# EAGLE design MOL-v1 (EAGLE 8.2.2)
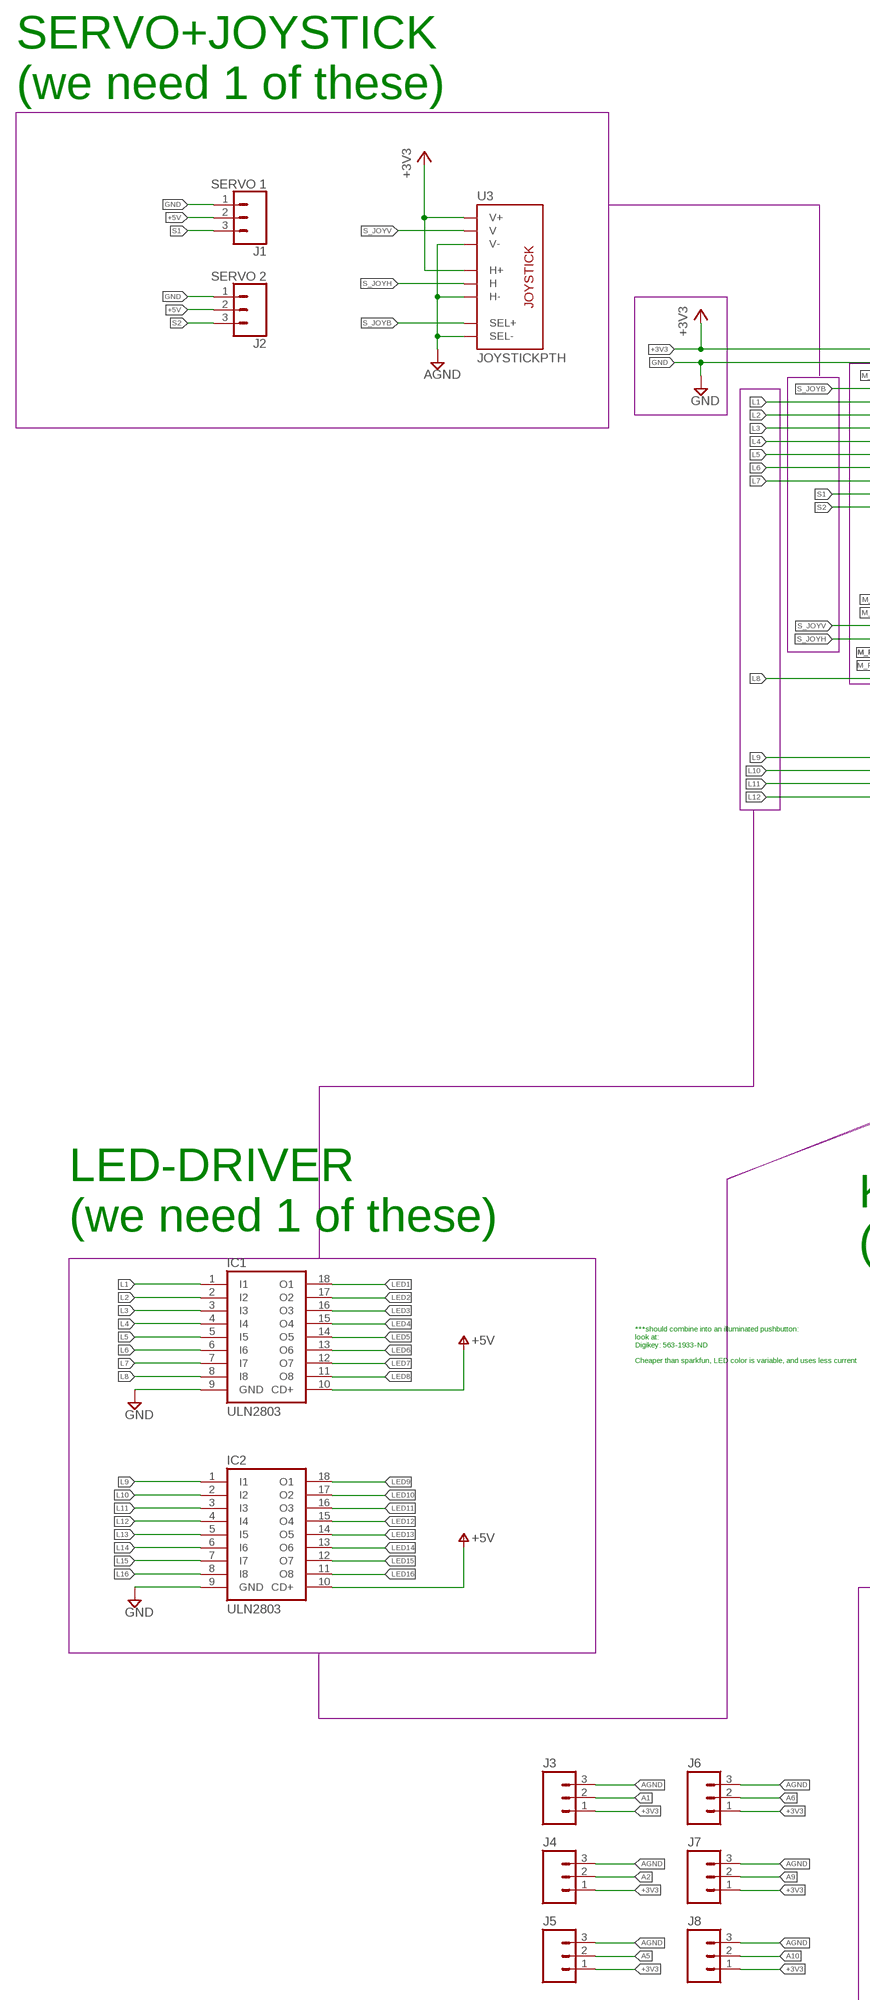
[diagram p0: schematic, sheet 1, part 1 of 2]
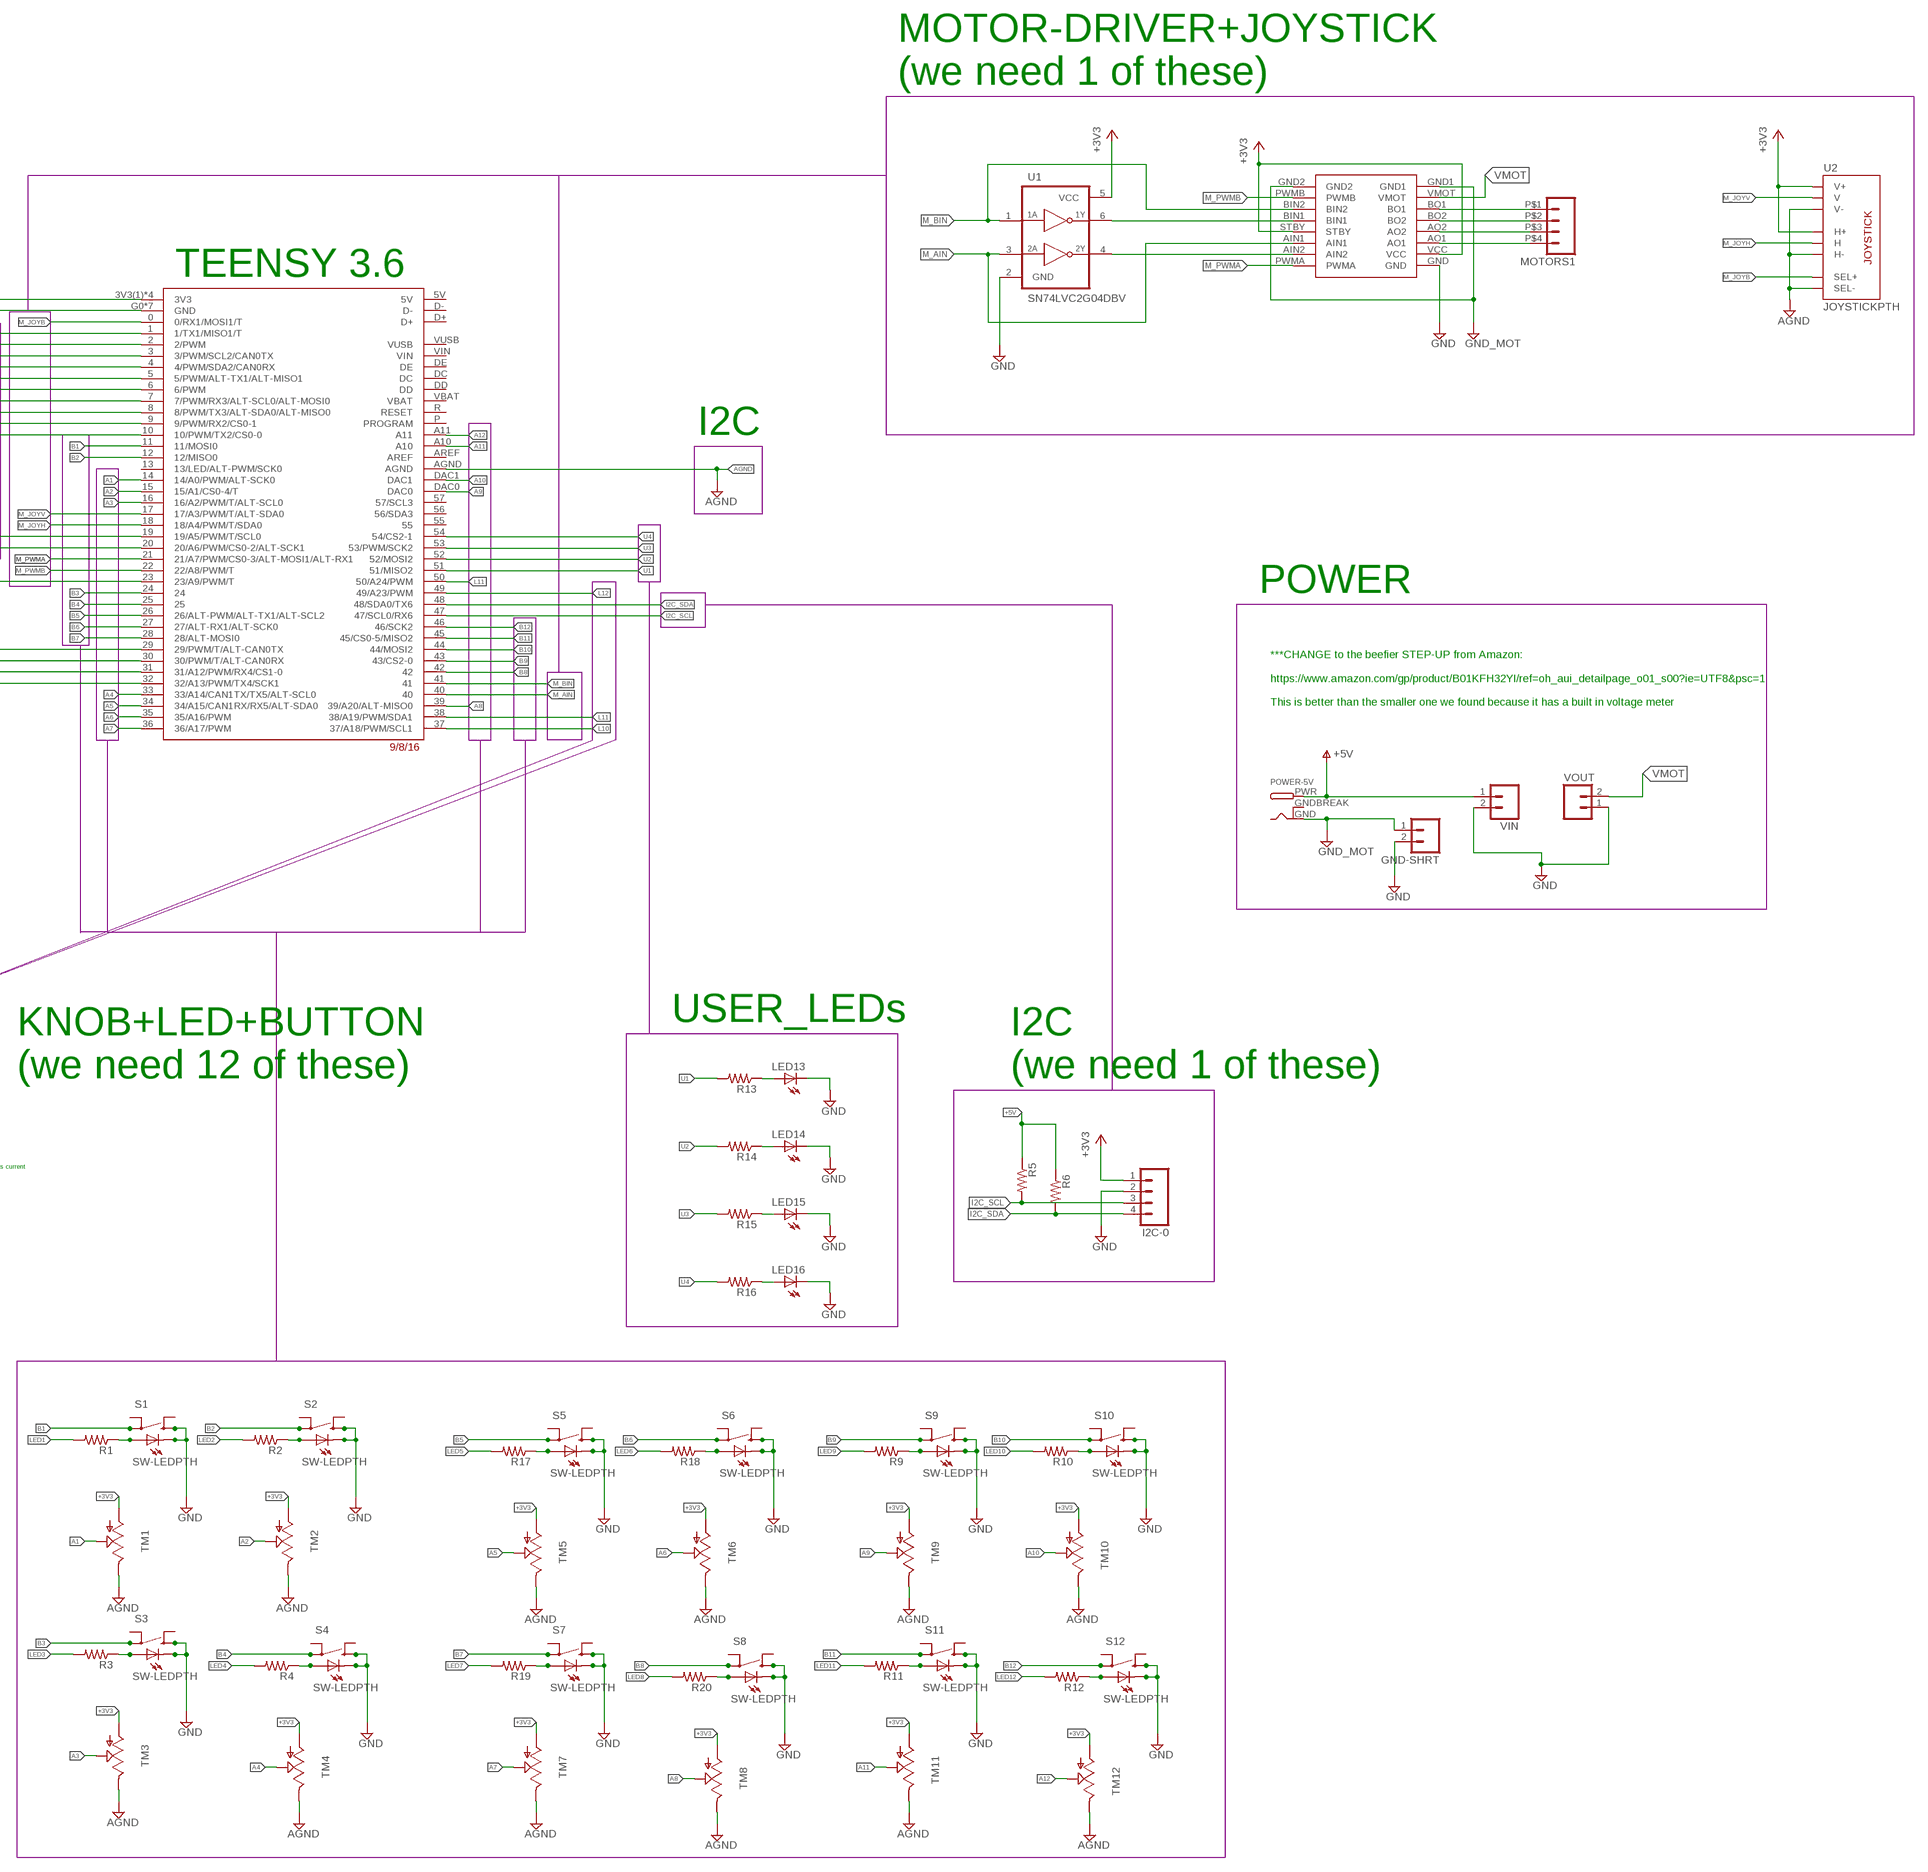
[diagram p1: schematic, sheet 1, part 2 of 2]

## Parts
GND-SHRT  M02LOCK  [1X02_LOCK]
I2C-0  M04LOCK  [1X04_LOCK]
IC1  ULN2803  ULN2803A  [DIL18]
IC2  ULN2803  ULN2803A  [DIL18]
J1  SERVO 1  CONN_03LOCK  [1X03_LOCK@1]
J2  SERVO 2  CONN_03LOCK  [1X03_LOCK@1]
J3  M031X03_NO_SILK  [1X03_NO_SILK]
J4  M031X03_NO_SILK  [1X03_NO_SILK]
J5  M031X03_NO_SILK  [1X03_NO_SILK]
J6  M031X03_NO_SILK  [1X03_NO_SILK]
J7  M031X03_NO_SILK  [1X03_NO_SILK]
J8  M031X03_NO_SILK  [1X03_NO_SILK]
LED13  LED3MM  [LED3MM]
LED14  LED3MM  [LED3MM]
LED15  LED3MM  [LED3MM]
LED16  LED3MM  [LED3MM]
MOTORS1  M04  [SPRINGTERMINAL-2.54MM-4]
POWER-5V  DCBARRELPTH  [DCJACK_2MM_PTH]
R1  RESISTOREZ  [AXIAL-0.3EZ]
R2  RESISTOREZ  [AXIAL-0.3EZ]
R3  RESISTOREZ  [AXIAL-0.3EZ]
R4  RESISTOREZ  [AXIAL-0.3EZ]
R5  RESISTOREZ  [AXIAL-0.3EZ]
R6  RESISTOREZ  [AXIAL-0.3EZ]
R9  RESISTOREZ  [AXIAL-0.3EZ]
R10  RESISTOREZ  [AXIAL-0.3EZ]
R11  RESISTOREZ  [AXIAL-0.3EZ]
R12  RESISTOREZ  [AXIAL-0.3EZ]
R13  RESISTOREZ  [AXIAL-0.3EZ]
R14  RESISTOREZ  [AXIAL-0.3EZ]
R15  RESISTOREZ  [AXIAL-0.3EZ]
R16  RESISTOREZ  [AXIAL-0.3EZ]
R17  RESISTOREZ  [AXIAL-0.3EZ]
R18  RESISTOREZ  [AXIAL-0.3EZ]
R19  RESISTOREZ  [AXIAL-0.3EZ]
R20  RESISTOREZ  [AXIAL-0.3EZ]
S1  SW-LEDPTH  [TR2-SWITCH-MOMENTARY-LED]
S2  SW-LEDPTH  [TR2-SWITCH-MOMENTARY-LED]
S3  SW-LEDPTH  [TR2-SWITCH-MOMENTARY-LED]
S4  SW-LEDPTH  [TR2-SWITCH-MOMENTARY-LED]
S5  SW-LEDPTH  [TR2-SWITCH-MOMENTARY-LED]
S6  SW-LEDPTH  [TR2-SWITCH-MOMENTARY-LED]
S7  SW-LEDPTH  [TR2-SWITCH-MOMENTARY-LED]
S8  SW-LEDPTH  [TR2-SWITCH-MOMENTARY-LED]
S9  SW-LEDPTH  [TR2-SWITCH-MOMENTARY-LED]
S10  SW-LEDPTH  [TR2-SWITCH-MOMENTARY-LED]
S11  SW-LEDPTH  [TR2-SWITCH-MOMENTARY-LED]
S12  SW-LEDPTH  [TR2-SWITCH-MOMENTARY-LED]
TM1  TRIM  [TRIM-PCB-9MM]
TM2  TRIM  [TRIM-PCB-9MM]
TM3  TRIM  [TRIM-PCB-9MM]
TM4  TRIM  [TRIM-PCB-9MM]
TM5  TRIM  [TRIM-PCB-9MM]
TM6  TRIM  [TRIM-PCB-9MM]
TM7  TRIM  [TRIM-PCB-9MM]
TM8  TRIM  [TRIM-PCB-9MM]
TM9  TRIM  [TRIM-PCB-9MM]
TM10  TRIM  [TRIM-PCB-9MM]
TM11  TRIM  [TRIM-PCB-9MM]
TM12  TRIM  [TRIM-PCB-9MM]
U1  SN74LVC2G04DBV  [SOT23-6]
U2  JOYSTICKPTH  [JOYSTICK]
U3  JOYSTICKPTH  [JOYSTICK]
U$1  TEENSY3_6--ALLPINS  [T36]
U$7  POLOLU_TB6612FNG  [POLOLU_TB6612FNG]
VIN  M02LOCK  [1X02_LOCK]
VOUT  M02LOCK  [1X02_LOCK]

## Nets
+3V3: I2C-0.1 J3.1 J4.1 J5.1 J6.1 J7.1 J8.1 TM1.1(A) TM2.1(A) TM3.1(A) TM4.1(A) TM5.1(A) TM6.1(A) TM7.1(A) TM8.1(A) TM9.1(A) TM10.1(A) TM11.1(A) TM12.1(A) U1.5(VCC) U2.H1(H+) U2.V1(V+) U3.H1(H+) U3.V1(V+) U$1.3V3(1)(3V3) U$1.3V3(2)(3V3) U$1.3V3(3)(3V3) U$1.3V3(4)(3V3) U$7.STBY U$7.VCC
+5V [Power]: IC1.10(CD+) IC2.10(CD+) J1.2 J2.2 POWER-5V.PWR R5.P$1 R6.P$1 VIN.1 ; supply symbol labelled V+
A1 [Analog Sig]: J3.2 TM1.2(S) U$1.14(14/A0/PWM/ALT-SCK0)
A2 [Analog Sig]: J4.2 TM2.2(S) U$1.15(15/A1/CS0-4/T)
A3 [Analog Sig]: TM3.2(S) U$1.16(16/A2/PWM/T/ALT-SCL0)
A4 [Analog Sig]: TM4.2(S) U$1.33(33/A14/CAN1TX/TX5/ALT-SCL0)
A5 [Analog Sig]: J5.2 TM5.2(S) U$1.34(34/A15/CAN1RX/RX5/ALT-SDA0)
A6 [Analog Sig]: J6.2 TM6.2(S) U$1.35(35/A16/PWM)
A7 [Analog Sig]: TM7.2(S) U$1.36(36/A17/PWM)
A8 [Analog Sig]: TM8.2(S) U$1.39(39/A20/ALT-MISO0)
A9 [Analog Sig]: J7.2 TM9.2(S) U$1.DAC0
A10 [Analog Sig]: J8.2 TM10.2(S) U$1.DAC1
A11 [Analog Sig]: TM11.2(S) U$1.A10
A12 [Analog Sig]: TM12.2(S) U$1.A11
AGND [Analog Sig]: J3.3 J4.3 J5.3 J6.3 J7.3 J8.3 TM1.3(E) TM2.3(E) TM3.3(E) TM4.3(E) TM5.3(E) TM6.3(E) TM7.3(E) TM8.3(E) TM9.3(E) TM10.3(E) TM11.3(E) TM12.3(E) U2.B2A(SEL-) U2.H3(H-) U2.V3(V-) U3.B2A(SEL-) U3.H3(H-) U3.V3(V-) U$1.AGND
B1: S1.3 U$1.11(11/MOSI0)
B2: S2.3 U$1.12(12/MISO0)
B3: S3.3 U$1.24
B4: S4.3 U$1.25
B5: S5.3 U$1.26(26/ALT-PWM/ALT-TX1/ALT-SCL2)
B6: S6.3 U$1.27(27/ALT-RX1/ALT-SCK0)
B7: S7.3 U$1.28(28/ALT-MOSI0)
B8: S8.3 U$1.42
B9: S9.3 U$1.43(43/CS2-0)
B10: S10.3 U$1.44(44/MOSI2)
B11: S11.3 U$1.45(45/CS0-5/MISO2)
B12: S12.3 U$1.46(46/SCK2)
GND: GND-SHRT.2 I2C-0.2 IC1.9(GND) IC2.9(GND) J1.1 J2.1 LED13.K(C) LED14.K(C) LED15.K(C) LED16.K(C) S1.1 S1.C S2.1 S2.C S3.1 S3.C S4.1 S4.C S5.1 S5.C S6.1 S6.C S7.1 S7.C S8.1 S8.C S9.1 S9.C S10.1 S10.C S11.1 S11.C S12.1 S12.C U1.2(GND) U$1.G0(GND) U$1.G1(GND) U$1.G2(GND) U$1.G3(GND) U$1.G4(GND) U$1.G5(GND) U$1.G6(GND) U$7.GND VIN.2 VOUT.1
GND_MOT [Power]: GND-SHRT.1 POWER-5V.GND U$7.GND1 U$7.GND2
I2C_SCL: I2C-0.3 R5.P$2 U$1.47(47/SCL0/RX6)
I2C_SDA: I2C-0.4 R6.P$2 U$1.48(48/SDA0/TX6)
L1: IC1.1(I1) U$1.2(2/PWM)
L2: IC1.2(I2) U$1.3(3/PWM/SCL2/CAN0TX)
L3: IC1.3(I3) U$1.4(4/PWM/SDA2/CAN0RX)
L4: IC1.4(I4) U$1.5(5/PWM/ALT-TX1/ALT-MISO1)
L5: IC1.5(I5) U$1.6(6/PWM)
L6: IC1.6(I6) U$1.7(7/PWM/RX3/ALT-SCL0/ALT-MOSI0)
L7: IC1.7(I7) U$1.8(8/PWM/TX3/ALT-SDA0/ALT-MISO0)
L8: IC1.8(I8) U$1.23(23/A9/PWM/T)
L9: IC2.1(I1) U$1.29(29/PWM/T/ALT-CAN0TX)
L10: IC2.2(I2) U$1.30(30/PWM/T/ALT-CAN0RX) U$1.37(37/A18/PWM/SCL1)
L11: IC2.3(I3) U$1.31(31/A12/PWM/RX4/CS1-0) U$1.38(38/A19/PWM/SDA1) U$1.50(50/A24/PWM)
L12: IC2.4(I4) U$1.32(32/A13/PWM/TX4/SCK1) U$1.49(49/A23/PWM)
L13: IC2.5(I5)
L14: IC2.6(I6)
L15: IC2.7(I7)
L16: IC2.8(I8)
LED1: IC1.18(O1) R1.P$2
LED2: IC1.17(O2) R2.P$2
LED3: IC1.16(O3) R3.P$2
LED4: IC1.15(O4) R4.P$2
LED5: IC1.14(O5) R17.P$2
LED6: IC1.13(O6) R18.P$2
LED7: IC1.12(O7) R19.P$2
LED8: IC1.11(O8) R20.P$2
LED9: IC2.18(O1) R9.P$2
LED10: IC2.17(O2) R10.P$2
LED11: IC2.16(O3) R11.P$2
LED12: IC2.15(O4) R12.P$2
LED13: IC2.14(O5)
LED14: IC2.13(O6)
LED15: IC2.12(O7)
LED16: IC2.11(O8)
M_AIN: U1.3(2A) U$1.40 U$7.AIN1
M_BIN: U1.1(1A) U$1.41 U$7.BIN2
M_JOYB: U2.B1A(SEL+) U$1.0(0/RX1/MOSI1/T)
M_JOYH [Analog Sig]: U2.H2(H) U$1.18(18/A4/PWM/T/SDA0)
M_JOYV [Analog Sig]: U2.V2(V) U$1.17(17/A3/PWM/T/ALT-SDA0)
M_PWMA: U$1.21(21/A7/PWM/CS0-3/ALT-MOSI1/ALT-RX1) U$7.PWMA
M_PWMB: U$1.22(22/A8/PWM/T) U$7.PWMB
N$1: R1.P$1 S1.A
N$2: LED13.A R13.P$1
N$3: LED14.A R14.P$1
N$4: LED15.A R15.P$1
N$5: U1.6(1Y) U$7.BIN1
N$6: U1.4(2Y) U$7.AIN2
N$7: LED16.A R16.P$1
N$8: R2.P$1 S2.A
N$9: R3.P$1 S3.A
N$10: R4.P$1 S4.A
N$15: R9.P$1 S9.A
N$16: R10.P$1 S10.A
N$17: R11.P$1 S11.A
N$18: R12.P$1 S12.A
N$19: R17.P$1 S5.A
N$20: R18.P$1 S6.A
N$21: R19.P$1 S7.A
N$22: R20.P$1 S8.A
N$45 [Power]: MOTORS1.P$1 U$7.BO1
N$46 [Power]: MOTORS1.P$2 U$7.BO2
N$52 [Power]: MOTORS1.P$3 U$7.AO2
N$54 [Power]: MOTORS1.P$4 U$7.AO1
S1: J1.3 U$1.9(9/PWM/RX2/CS0-1)
S2: J2.3 U$1.10(10/PWM/TX2/CS0-0)
S_JOYB: U3.B1A(SEL+) U$1.1(1/TX1/MISO1/T)
S_JOYH [Analog Sig]: U3.H2(H) U$1.20(20/A6/PWM/CS0-2/ALT-SCK1)
S_JOYV [Analog Sig]: U3.V2(V) U$1.19(19/A5/PWM/T/SCL0)
U1: R13.P$2 U$1.51(51/MISO2)
U2: R14.P$2 U$1.52(52/MOSI2)
U3: R15.P$2 U$1.53(53/PWM/SCK2)
U4: R16.P$2 U$1.54(54/CS2-1)
VMOT [Power]: U$7.VMOT VOUT.2
Unconnected: S1.2 S1.4 S2.2 S2.4 S3.2 S3.4 S4.2 S4.4 S5.2 S5.4 S6.2 S6.4 S7.2 S7.4 S8.2 S8.4 S9.2 S9.4 S10.2 S10.4 S11.2 S11.4 S12.2 S12.4 U$1.5V U$1.13(13/LED/ALT-PWM/SCK0) U$1.55 U$1.56(56/SDA3) U$1.57(57/SCL3) U$1.AREF U$1.D+ U$1.D- U$1.DC U$1.DD U$1.DE U$1.P(PROGRAM) U$1.R(RESET) U$1.VBAT U$1.VIN U$1.VUSB

## Notes on the sheet
- SERVO+JOYSTICK
  (we need 1 of these)
- MOTOR-DRIVER+JOYSTICK
  (we need 1 of these)
- TEENSY 3.6
- I2C
- POWER
- ***CHANGE to the beefier STEP-UP from Amazon:
  
  https://www.amazon.com/gp/product/B01KFH32YI/ref=oh_aui_detailpage_o01_s00?ie=UTF8&psc=1
  
  This is better than the smaller one we found because it has a built in voltage meter
- USER_LEDs
- LED-DRIVER
  (we need 1 of these)
- KNOB+LED+BUTTON
  (we need 12 of these)
- I2C
  (we need 1 of these)
- ***should combine into an illuminated pushbutton:
  look at:
  Digikey: 563-1933-ND
  
  Cheaper than sparkfun, LED color is variable, and uses less current

## Power pins joined to a net without a drawn wire
GNDBREAK: POWER-5V.GNDBREAK

## Library data of the parts
GND-SHRT VIN VOUT = CMU-ArtFab:M02: Header 2 Standard 2-pin 0.1" header. Use with straight break away headers (SKU : PRT-00116), right angle break away headers (PRT-00553), swiss pins (PRT-00743), machine pins (PRT-00117), and female headers (PRT-00115). Molex polarized connector foot print use with SKU : PRT-08233 with associated crimp pins and housings.
I2C-0 MOTORS1 = CMU-ArtFab:M04: Header 4 Standard 4-pin 0.1" header. Use with straight break away headers (SKU : PRT-00116), right angle break away headers (PRT-00553), swiss pins (PRT-00743), machine pins (PRT-00117), and female headers (PRT-00115). Molex polarized connector foot print use with SKU : PRT-08231 with associated crimp pins and housings. 1MM SMD Version SKU: PRT-10208
IC1 IC2 = uln-udn:ULN2803A: DRIVER ARRAY
J1 J2 = SparkFun-Connectors:CONN_03: Multi connection point. Often used as Generic Header-pin footprint for 0.1 inch spaced/style header connections On any of the 0.1 inch spaced packages, you can populate with these: Break Away Headers - Straight <https://www.sparkfun.com/products/116> (PRT-00116) Break Away Male Headers - Right Angle <https://www.sparkfun.com/products/553> (PRT-00553) Female Headers <https://www.sparkfun.com/products/115> (PRT-00115) Break Away Headers - Machine Pin <https://www.sparkfun.com/products/117> (PRT-00117) Break Away Female Headers - Swiss Machine Pin <https://www.sparkfun.com/products/743> (PRT-00743) Stackable Header - 3 Pin (Female, 0.1") <https://www.sparkfun.com/products/13875> (PRT-13875) For SCREWTERMINALS and SPRING TERMINALS visit here: Screw Terimnals on SparkFun.com <https://www.sparkfun.com/search/results?term=Screw+Terminals> (5mm/3.5mm/2.54mm spacing) This device is also useful as a general connection point to wire up your design to another part of your project. Our various solder wires solder well into these plated through hole pads. Hook-Up Wire - Assortment (Stranded, 22 AWG) <https://www.sparkfun.com/products/11375> (PRT-11375) Hook-Up Wire - Assortment (Solid Core, 22 AWG) <https://www.sparkfun.com/products/11367> (PRT-11367) View the entire wire category on our website here <https://www.sparkfun.com/categories/141> Special notes: Molex polarized connector foot print use with SKU : PRT-08232 with associated crimp pins and housings.
J3-J8 = SparkFun-Connectors:M03: Header 3 Standard 3-pin 0.1" header. Use with straight break away headers (SKU : PRT-00116), right angle break away headers (PRT-00553), swiss pins (PRT-00743), machine pins (PRT-00117), and female headers (PRT-00115). Molex polarized connector foot print use with SKU : PRT-08232 with associated crimp pins and housings.
LED13-LED16 = led:LED: LED OSRAM: - CHIPLED LG R971, LG N971, LY N971, LG Q971, LY Q971, LO R971, LY R971 LH N974, LH R974 LS Q976, LO Q976, LY Q976 LO Q996 - Hyper CHIPLED LW Q18S LB Q993, LB Q99A, LB R99A - SideLED LS A670, LO A670, LY A670, LG A670, LP A670 LB A673, LV A673, LT A673, LW A673 LH A674 LY A675 LS A676, LA A676, LO A676, LY A676, LW A676 LS A679, LY A679, LG A679 - Hyper Micro SIDELED® LS Y876, LA Y876, LO Y876, LY Y876 LT Y87S - SmartLED LW L88C, LW L88S LB L89C, LB L89S, LG L890 LS L89K, LO L89K, LY L89K LS L896, LA L896, LO L896, LY L896 - TOPLED LS T670, LO T670, LY T670, LG T670, LP T670 LSG T670, LSP T670, LSY T670, LOP T670, LYG T670 LG T671, LOG T671, LSG T671 LB T673, LV T673, LT T673, LW T673 LH T674 LS T676, LA T676, LO T676, LY T676, LB T676, LH T676, LSB T676, LW T676 LB T67C, LV T67C, LT T67C, LS T67K, LO T67K, LY T67K, LW E67C LS E67B, LA E67B, LO E67B, LY E67B, LB E67C, LV E67C, LT E67C LW T67C LS T679, LY T679, LG T679 LS T770, LO T770, LY T770, LG T770, LP T770 LB T773, LV T773, LT T773, LW T773 LH T774 LS E675, LA E675, LY E675, LS T675 LS T776, LA T776, LO T776, LY T776, LB T776 LHGB T686 LT T68C, LB T68C - Hyper Mini TOPLED® LB M676 - Mini TOPLED Santana® LG M470 LS M47K, LO M47K, LY M47K Source: http://www.osram.convergy.de LUXEON: - LUMILED® LXK2-PW12-R00, LXK2-PW12-S00, LXK2-PW14-U00, LXK2-PW14-V00 LXK2-PM12-R00, LXK2-PM12-S00, LXK2-PM14-U00 LXK2-PE12-Q00, LXK2-PE12-R00, LXK2-PE12-S00, LXK2-PE14-T00, LXK2-PE14-U00 LXK2-PB12-K00, LXK2-PB12-L00, LXK2-PB12-M00, LXK2-PB14-N00, LXK2-PB14-P00, LXK2-PB14-Q00 LXK2-PR12-L00, LXK2-PR12-M00, LXK2-PR14-Q00, LXK2-PR14-R00 LXK2-PD12-Q00, LXK2-PD12-R00, LXK2-PD12-S00 LXK2-PH12-R00, LXK2-PH12-S00 LXK2-PL12-P00, LXK2-PL12-Q00, LXK2-PL12-R00 Source: www.luxeon.com KINGBRIGHT: KA-3528ASYC Source: www.kingbright.com
POWER-5V = adafruit:DCBARREL: 2.0mm DC Barrel Jack DCJACK_2MM_PTH - Through Hole Jack (4UConnector: 05537)
R1-R6 R9-R20 = SparkFun-Resistors:RESISTOR: Resistor Basic schematic elements and footprints for 0603, 1206, and PTH resistors.
S1-S12 = Daniel:SW-LED: SWITCH PUSH SPST-NO 10MA 12V
TM1-TM12 = Daniel:TRIM
U1 = 74LV:SN74LVC2G04: DUAL INVERTER GATE
U2 U3 = adafruit:JOYSTICK: Thumb Joystick Joystick commonly found in PS2 controllers. Two pots and a select switch. Adapted from Sparkfun Library (but for more common 6mm switch sticks)
U$1 = Teensy_3_6:TEENSY3_6--ALLPINS
U$7 = CMU-ArtFab:POLOLU_TB6612FNG

## Net classes
2 Power: width 0.508 mm, clearance 0.152 mm
3 Analog Sig: width 0.508 mm, clearance 0.152 mm

## Board
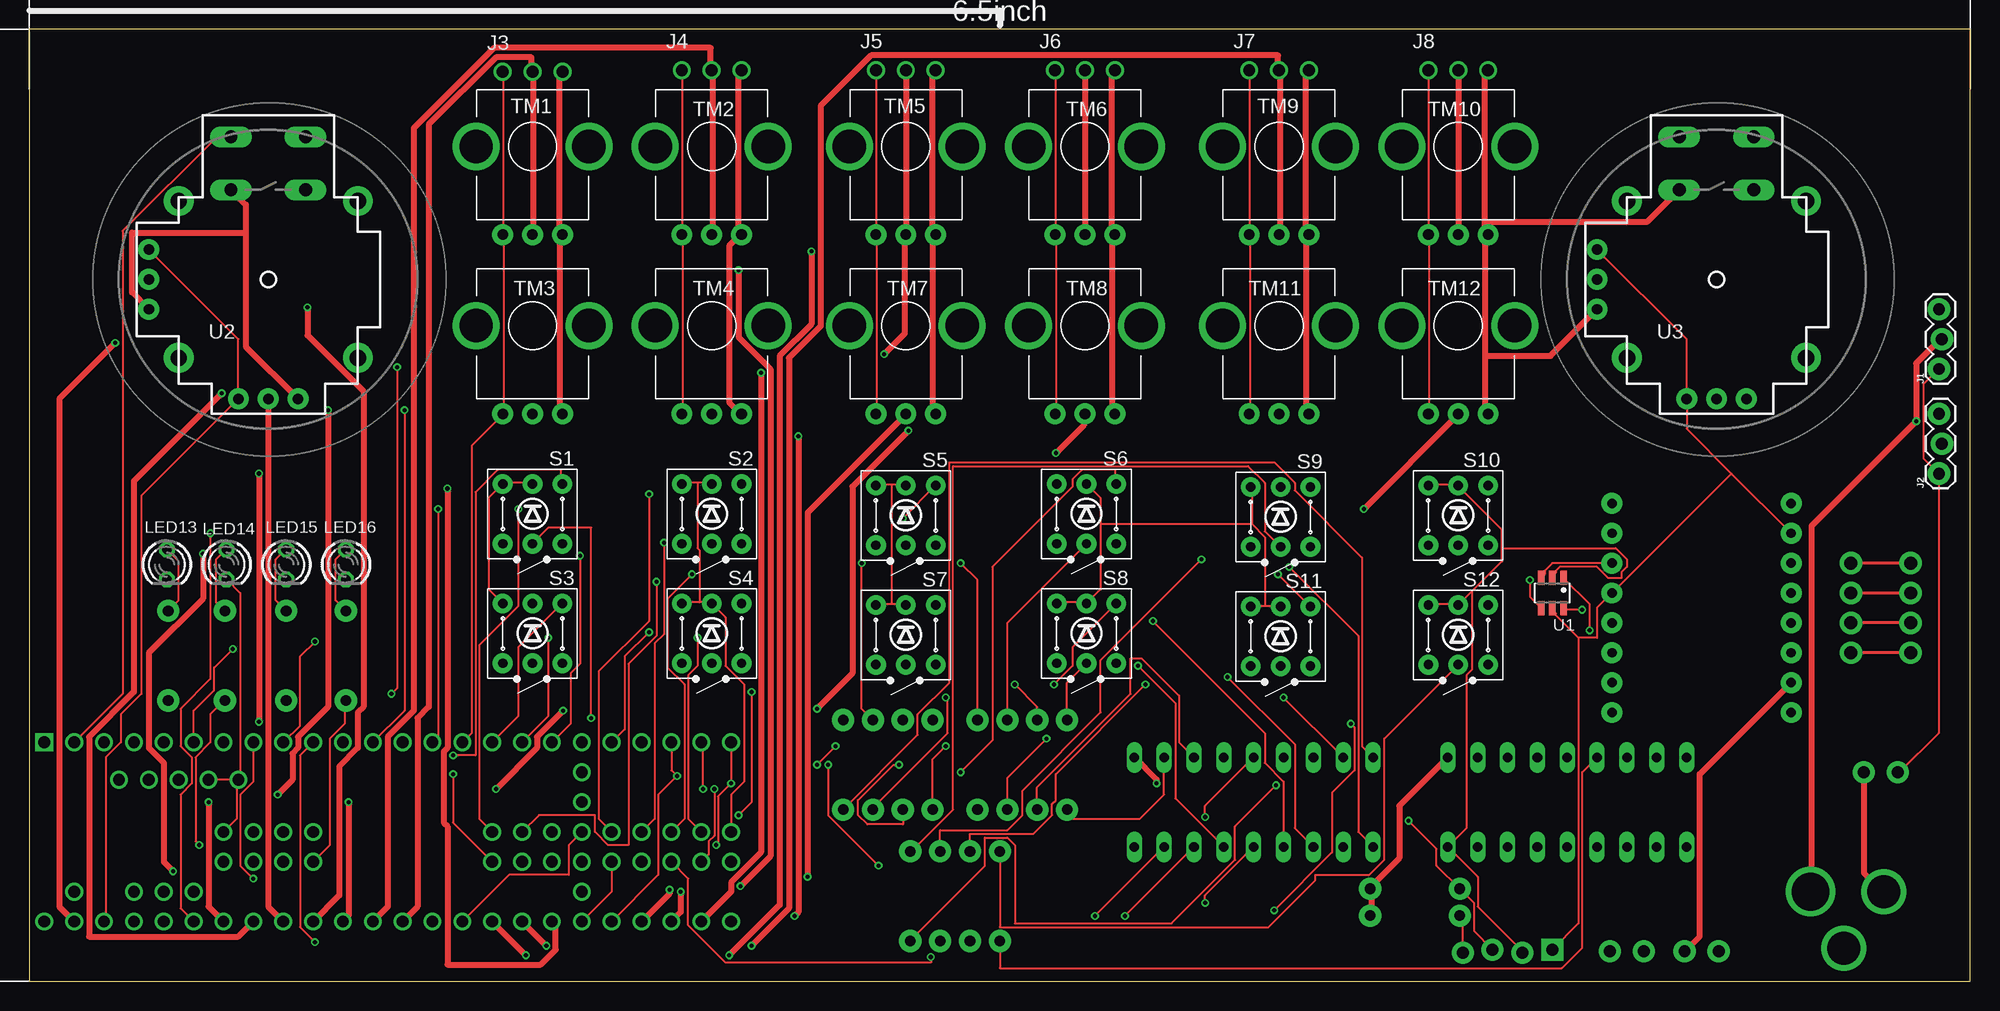
[diagram p2: board, top side]
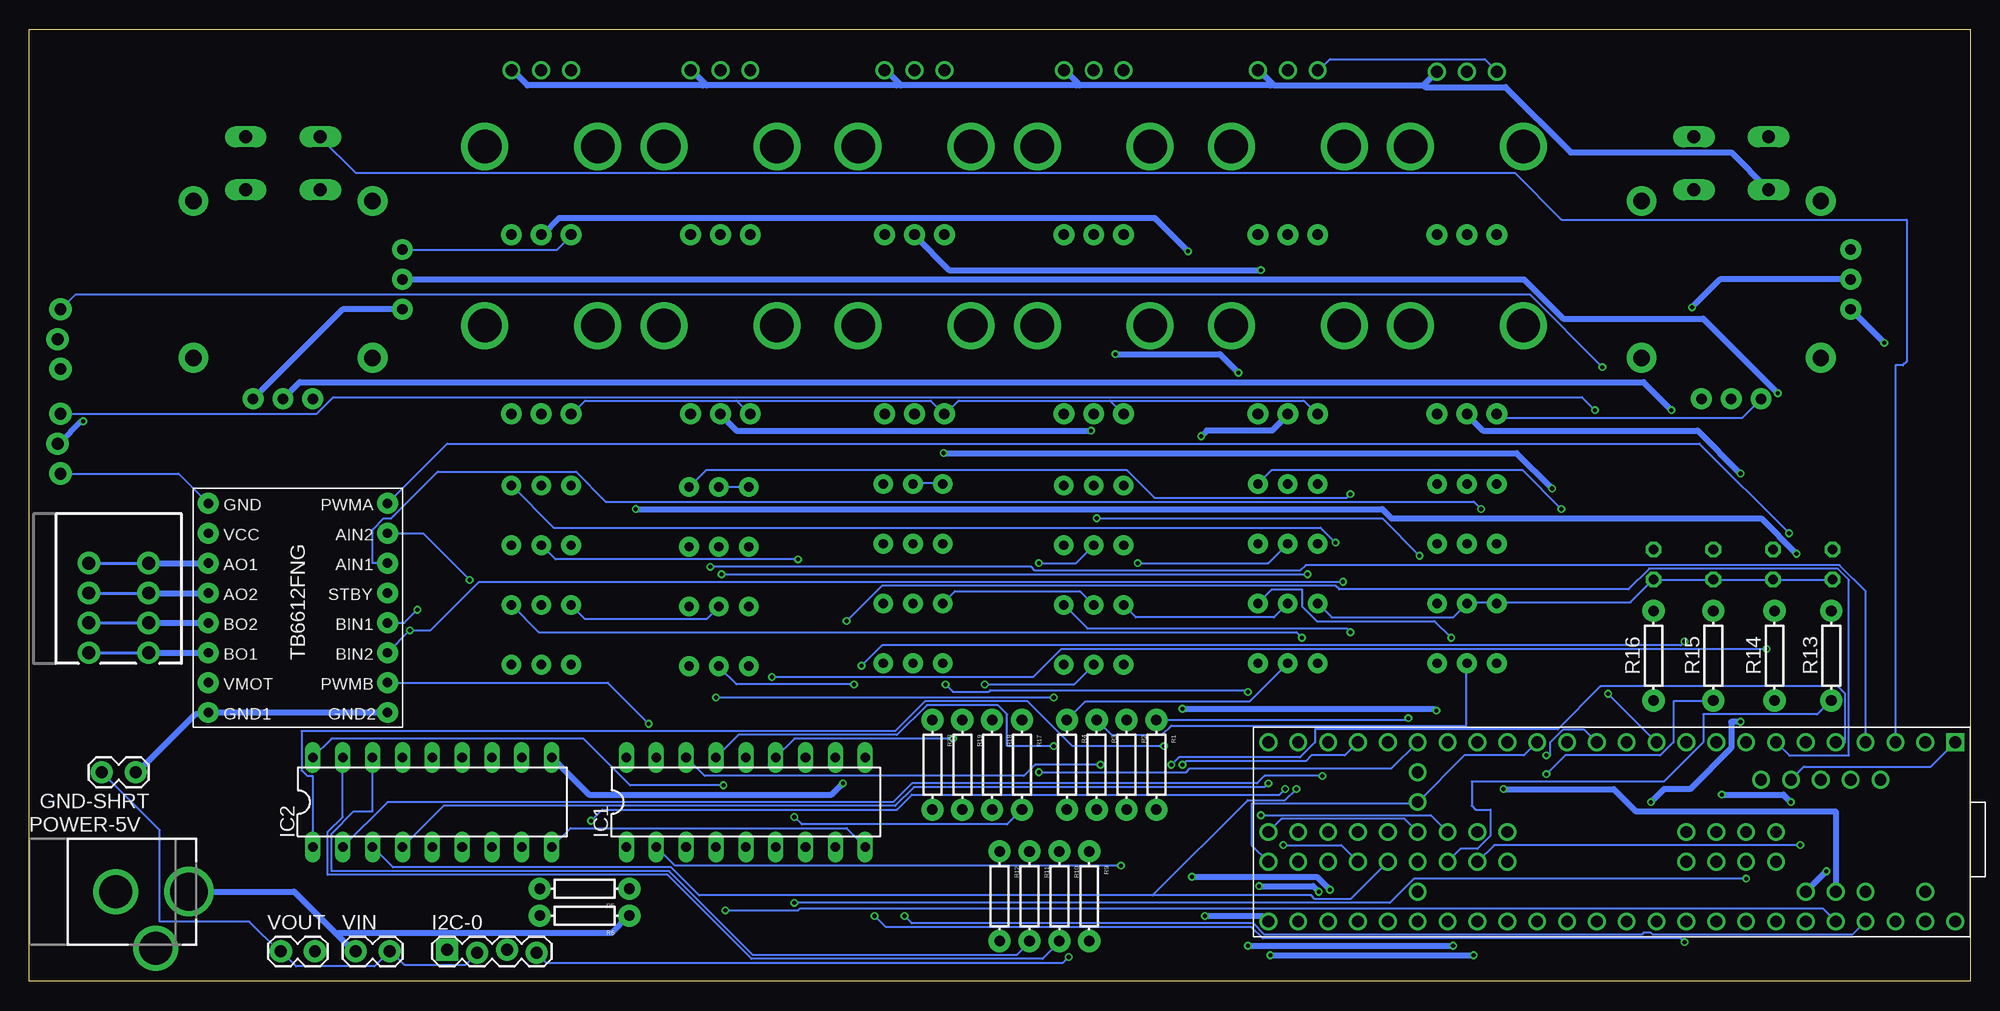
[diagram p3: board, bottom side, seen from below]

Size 165.08 x 80.95 mm. Coordinates in mm from the lower left corner, seen from the top.
Outline: 0,0 165.08,0 165.08,80.95 0,80.95 0,0
Copper layers (1*16): Top 0.035mm / dielectric 1.5mm / Bottom 0.035mm
Design rules "SeeedStudio_2layer_DRU_no_angle_20140221": minimum track width 6mil, minimum drill 12mil, track to track 6mil, track to pad 6mil, pad to pad 6mil, via to via 6mil, smd to smd 0mil, copper to edge 10mil, drill to drill 10mil, minimum pad ring 10mil, minimum via ring 6mil, stop-mask expansion 2mil, vias tented up to drill 100mil, thermal gap 10mil

### Footprints (pad centres in the part's own frame; a part is rotated, then mirrored left to right if it is on the bottom)
1X02_LOCK = drill 1.016 pad 1.88: 1 -0.178,0; 2 2.718,0
1X04_LOCK = drill 1.016 pad 1.88 square: 1 0,0.127 | drill 1.016 pad 1.88: 2 2.54,-0.127; 3 5.08,0.127; 4 7.62,-0.127
DIL18 = drill 0.813 long: 1 -10.16,-3.81; 2 -7.62,-3.81; 3 -5.08,-3.81; 4 -2.54,-3.81; 5 0,-3.81; 6 2.54,-3.81; 7 5.08,-3.81; 8 7.62,-3.81; 9 10.16,-3.81; 10 10.16,3.81; 11 7.62,3.81; 12 5.08,3.81; 13 2.54,3.81; 14 0,3.81; 15 -2.54,3.81; 16 -5.08,3.81; 17 -7.62,3.81; 18 -10.16,3.81
1X03_LOCK@1 = drill 1.016 pad 1.88: 1 0,0.127; 2 2.54,-0.127; 3 5.08,0.127
1X03_NO_SILK = drill 1.016 pad 1.524: 1 0,0; 2 2.54,0; 3 5.08,0
LED3MM = drill 0.813 octagon: A -1.27,0; K 1.27,0
SPRINGTERMINAL-2.54MM-4 = drill 1.1 pad 1.9: 1 7.62,-2.54; 2 5.08,-2.54; 3 2.54,-2.54; 4 0,-2.54; P$1 7.62,2.54; P$2 5.08,2.54; P$3 2.54,2.54; P$4 0,2.54
DCJACK_2MM_PTH = drill 2.8: GND 0,7.35; GNDBREAK 4.8,10.75 | drill 3.2: PWR 0,13.6
AXIAL-0.3EZ = drill 0.9 pad 1.88: P$1 -3.81,0; P$2 3.81,0
TR2-SWITCH-MOMENTARY-LED = drill 0.8 pad 1.676: 1 2.54,-2.54; 2 2.54,2.54; 3 -2.54,-2.54; 4 -2.54,2.54; A 0,2.54; C 0,-2.54
TRIM-PCB-9MM = drill 0.9 pad 1.778: 1 -2.54,-7.5; 2 0,-7.5; 3 2.54,-7.5 | drill 2.845 pad 4: 5 -4.8,0; 6 -4.8,0; M1 -4.8,0; M2 4.8,0
SOT23-6 = smd 0.55 x 1.2: 1 -0.95,-1.3; 2 0,-1.3; 3 0.95,-1.3; 4 0.95,1.3; 5 0,1.3; 6 -0.95,1.3
JOYSTICK = drill 1.1 pad 1.778 long: B1A -3.175,12.12; B1B 3.175,12.12; B2A -3.175,7.62; B2B 3.175,7.62 | drill 0.889 pad 1.778: H1 -2.54,-10.16; H2 0,-10.16; H3 2.54,-10.16; V1 -10.16,2.54; V2 -10.16,0; V3 -10.16,-2.54 | drill 1.397 pad 2.54: MOUNT1 -7.62,6.668; MOUNT2 -7.62,-6.668; MOUNT3 7.62,-6.668; MOUNT4 7.62,6.668
T36 = drill 1: 0 -15.24,-5.08; 1 -12.7,-5.08; 2 -10.16,-5.08; 3 -7.62,-5.08; 3V3(1) 17.78,-5.08; 3V3(2) 27.94,0; 3V3(3) -12.7,10.16; 3V3(4) 40.64,5.08; 4 -5.08,-5.08; 5 -2.54,-5.08; 5V -11.43,-1.905; 6 0,-5.08; 7 2.54,-5.08; 8 5.08,-5.08; 9 7.62,-5.08; 10 10.16,-5.08; 11 12.7,-5.08; 12 15.24,-5.08; 13 15.24,10.16; 14 12.7,10.16; 15 10.16,10.16; 16 7.62,10.16; 17 5.08,10.16; 18 2.54,10.16; 19 0,10.16; 20 -2.54,10.16; 21 -5.08,10.16; 22 -7.62,10.16; 23 -10.16,10.16; 24 20.32,-5.08; 25 22.86,-5.08; 26 25.4,-5.08; 27 27.94,-5.08; 28 30.48,-5.08; 29 33.02,-5.08; 30 35.56,-5.08; 31 38.1,-5.08; 32 40.64,-5.08; 33 40.64,10.16; 34 38.1,10.16; 35 35.56,10.16; 36 33.02,10.16; 37 30.48,10.16; 38 27.94,10.16; 39 25.4,10.16; 40 20.32,2.54; 41 22.86,2.54; 42 25.4,2.54; 43 30.48,2.54; 44 33.02,2.54; 45 35.56,2.54; 46 38.1,2.54; 47 38.1,5.08; 48 35.56,5.08; 49 33.02,5.08; 50 30.48,5.08; 51 25.4,5.08; 52 22.86,5.08; 53 20.32,5.08; 54 5.08,5.08; 55 2.54,5.08; 56 0,5.08; 57 -2.54,5.08; A10 -7.62,7.62; A11 -5.08,7.62; AGND -15.24,10.16; AREF -10.16,7.62; D+ -6.35,-1.905; D- -8.89,-1.905; DAC0 22.86,10.16; DAC1 20.32,10.16; DC 2.54,2.54; DD 5.08,2.54; DE 0,2.54; G1 27.94,2.54; G2 17.78,10.16; G3 40.64,2.54; G4 -3.81,-1.905; G5 -1.27,-1.905; G6 -2.54,2.54; P 27.94,5.08; R 27.94,7.62; VBAT 27.94,-2.54; VIN -17.78,10.16; VUSB -15.24,7.62 | drill 1 square: G0 -17.78,-5.08
POLOLU_TB6612FNG = drill 0.8 pad 1.778: AIN1 7.62,3.81; AIN2 7.62,6.35; AO1 -7.62,3.81; AO2 -7.62,1.27; BIN1 7.62,-1.27; BIN2 7.62,-3.81; BO1 -7.62,-3.81; BO2 -7.62,-1.27; GND -7.62,8.89; GND1 -7.62,-8.89; GND2 7.62,-8.89; PWMA 7.62,8.89; PWMB 7.62,-6.35; STBY 7.62,1.27; VCC -7.62,6.35; VMOT -7.62,-6.35

### Placement (x,y rotation side)
GND-SHRT  156.21,17.78 180 bottom
I2C-0  129.54,2.54 0 bottom
IC1  104.14,15.24 0 bottom
IC2  130.81,15.24 0 bottom
J1  162.56,52.07 90 top
J2  162.56,43.18 90 top
J3  40.26,77.34 0 top
J4  55.5,77.47 0 top
J5  72.01,77.47 0 top
J6  87.25,77.47 0 top
J7  103.76,77.47 0 top
J8  119,77.47 0 top
LED13  11.68,35.43 270 top
LED14  16.76,35.43 270 top
LED15  21.84,35.43 270 top
LED16  26.92,35.43 270 top
MOTORS1  157.48,35.56 270 bottom
POWER-5V  165.1,7.62 270 bottom
R1  69.22,18.41 270 bottom
R2  71.75,18.41 270 bottom
R3  74.3,18.41 270 bottom
R4  76.83,18.41 270 bottom
R5  117.86,7.87 180 bottom
R6  117.86,5.59 180 bottom
R9  74.93,7.24 270 bottom
R10  77.47,7.24 270 bottom
R11  80.01,7.24 270 bottom
R12  82.55,7.24 270 bottom
R13  11.81,27.69 270 bottom
R14  16.64,27.69 270 bottom
R15  21.84,27.69 270 bottom
R16  26.92,27.69 270 bottom
R17  80.64,18.41 270 bottom
R18  83.19,18.41 270 bottom
R19  85.72,18.41 270 bottom
R20  88.27,18.41 270 bottom
S1  42.8,39.75 180 top
S2  58.04,39.75 180 top
S3  42.8,29.59 180 top
S4  58.04,29.59 180 top
S5  74.55,39.62 180 top
S6  89.92,39.75 180 top
S7  74.55,29.46 180 top
S8  89.92,29.59 180 top
S9  106.43,39.5 180 top
S10  121.54,39.62 180 top
S11  106.43,29.34 180 top
S12  121.54,29.46 180 top
TM1  42.8,70.99 0 top
TM2  58.04,70.99 0 top
TM3  42.8,55.75 0 top
TM4  58.04,55.75 0 top
TM5  74.55,70.99 0 top
TM6  89.79,70.99 0 top
TM7  74.55,55.75 0 top
TM8  89.79,55.75 0 top
TM9  106.3,70.99 0 top
TM10  121.54,70.99 0 top
TM11  106.3,55.75 0 top
TM12  121.54,55.75 0 top
U1  129.54,33.02 180 top
U2  20.32,59.69 0 top
U3  143.51,59.69 0 top
U$1  19.05,15.24 180 bottom
U$7  142.24,31.75 0 bottom
VIN  137.16,2.54 0 bottom
VOUT  143.51,2.54 0 bottom

### Tracks (layer width: path | path; a pad name or v marks a point on that pad's centre or on a via)
+3V3
  Top 0.152: U$1.3V3(3) 6.51,5.24 6.51,19.05 7.78,20.32 7.78,22.7 9.53,24.45 9.53,41.27 U2.H1 17.78,54.61 U2.V1 | J3.1 40.32,77.31 40.32,63.5 TM1.1 40.32,63.34 40.32,48.26 TM3.1 40.16,48.1 37.62,45.56 37.62,21.11 U$1.3V3(1) | J4.1 55.56,77.47 55.56,63.5 TM2.1 55.56,63.34 55.56,48.26 TM4.1 | J5.1 72.07,77.47 72.07,63.5 TM5.1 72.07,63.34 72.07,48.26 TM7.1 | J6.1 87.31,77.47 87.31,63.5 TM6.1 87.31,63.34 87.31,48.26 TM8.1 | J7.1 103.82,77.47 103.82,63.5 TM9.1 103.82,63.34 103.82,48.26 TM11.1 | J8.1 119.06,77.47 119.06,63.5 TM10.1 119.06,63.34 119.06,48.26 TM12.1 | 131.76,29.21 129.86,31.11 129.86,31.27 129.54,31.59 U1.5 | 131.76,29.21 133.35,29.21 133.35,31.75 U$7.STBY 144.78,43.18 | 131.76,29.21 131.76,4.92 129.54,2.7 I2C-0.1 | U3.V1 140.97,54.61 U3.H1 140.97,46.99 144.78,43.18 | 144.78,43.18 U$7.VCC
  Bottom 0.152: U$1.3V3(1) 37.94,19.21 43.02,19.21 U$1.3V3(2) 47.15,15.08 61.12,15.08 61.12,11.59 U$1.3V3(4) | J3.1 40.32,77.47 41.27,78.42 54.45,78.42 55.4,77.47 J4.1 | U2.H1 19.37,47.94 40.01,47.94 40.16,48.1 TM3.1 | 73.18,49.37 72.07,48.26 TM7.1 | 73.18,49.37 86.04,49.37 87.15,48.26 TM8.1 87.31,48.26 88.42,49.37 104.93,49.37 | 104.93,49.37 103.82,48.26 TM11.1 | 104.93,49.37 117.79,49.37 118.9,48.26 TM12.1 | U3.V1 120.17,62.23 119.06,63.34 TM10.1 | 73.18,49.37 56.67,49.37 55.56,48.26 TM4.1
+5V  (via drill 0.35)
  Top 0.508: R6.P$1 114.14,5.71 114.14,7.78 R5.P$1 114.14,8.1 116.52,10.48 116.52,14.92 IC2.10 | IC1.10 95.89,17.14 v95.89,16.83 | J1.2 162.56,54.61 160.5,52.55 v160.5,47.62 151.61,38.73 151.61,7.62 POWER-5V.PWR
  Bottom 0.508: v95.89,16.83 96.84,15.88 117.47,15.88 IC2.10 | v160.5,47.62 160.66,47.62 162.56,45.72 J2.2 | 138.91,3.97 142.56,7.62 POWER-5V.PWR | 138.91,3.97 137.48,2.54 VIN.1 | R6.P$1 114.14,5.56 115.57,4.13 138.75,4.13 138.91,3.97
A1
  Top 0.508: U$1.14 33.02,6.35 33.02,22.38 33.97,23.34 33.97,72.87 39.69,78.58 42.7,78.58 42.7,77.47 J3.2 42.86,77.15 42.86,63.5 TM1.2
A2
  Top 0.508: U$1.15 30.48,6.35 30.48,20.8 32.7,23.02 32.7,72.55 39.53,79.38 57.94,79.38 57.94,77.47 J4.2 58.1,77.31 58.1,63.5 TM2.2
A3  (via drill 0.35)
  Top 0.508: U$1.16 27.15,5.56 v27.15,15.24 | v19.53,43.18 v19.53,22.07
  Bottom 0.508: v27.15,15.24 26.04,16.35 23.81,16.35 20.32,19.84 20.32,22.07 v19.53,22.07 | v19.53,43.18 23.18,46.83 41.43,46.83 42.7,48.1 TM3.2
A4  (via drill 0.35)
  Top 0.508: v65.09,5.56 65.41,5.87 v65.41,46.35
  Bottom 0.508: U$1.33 60.17,5.56 v65.09,5.56 | v65.41,46.35 64.93,46.83 59.37,46.83 58.1,48.1 TM4.2
A5  (via drill 0.35)
  Top 0.508: U$1.34 59.69,7.62 59.69,8.41 62.23,10.95 v62.23,51.75 | v72.71,53.34 74.45,55.09 74.45,63.34 TM5.2 74.61,63.66 74.61,77.47 J5.2
  Bottom 0.508: v62.23,51.75 63.82,53.34 v72.71,53.34
A6  (via drill 0.35)
  Top 0.508: U$1.35 55.4,5.87 v55.4,7.62 | v60.48,8.1 63.02,10.64 63.02,52.07 60.33,54.77 v60.33,60.48 | J6.2 89.85,77.47 89.85,63.5 TM6.2
  Bottom 0.508: v55.4,7.62 55.88,8.1 v60.48,8.1 | v60.33,60.48 86.84,60.48 89.69,63.34 TM6.2
A7  (via drill 0.35)
  Top 0.508: U$1.36 54.45,7.46 v54.45,7.78 | v66.2,8.89 66.2,39.85 74.45,48.1 TM7.2
  Bottom 0.508: v54.45,7.78 55.56,8.89 v66.2,8.89
A8  (via drill 0.35)
  Top 0.508: U$1.39 44.77,4.76 44.77,2.7 43.5,1.43 35.56,1.43 35.56,13.18 35.24,13.49 35.24,19.53 35.56,19.84 v35.56,41.91 | v87.31,44.93 89.69,47.31 89.69,48.1 TM8.2
  Bottom 0.508: v35.56,41.91 38.58,44.93 v87.31,44.93
A9  (via drill 0.35)
  Top 0.508: v43.97,3.02 U$1.DAC0 | v61.44,3.02 64.61,6.19 64.61,53.02 67.31,55.72 67.31,74.45 71.6,78.74 106.2,78.74 106.2,77.47 J7.2 106.36,77.31 106.36,63.5 TM9.2
  Bottom 0.508: v61.44,3.02 v43.97,3.02
A10  (via drill 0.35)
  Top 0.508: v42.23,2.22 U$1.DAC1 | v59.53,2.22 63.82,6.51 63.82,53.18 66.52,55.88 v66.52,62.07 | J8.2 121.6,77.47 121.6,63.5 TM10.2
  Bottom 0.508: v59.53,2.22 v42.23,2.22 | v66.52,62.07 69.37,64.93 120.02,64.93 121.44,63.5 TM10.2
A11  (via drill 0.35)
  Top 0.508: v39.69,16.35 43.18,19.84 43.18,20.8 v45.4,23.02 | v66.99,23.18 70.01,26.19 70.01,42.07 v74.77,46.83
  Bottom 0.508: U$1.A10 11.43,14.45 28.42,14.45 30.32,16.35 v39.69,16.35 | v45.4,23.02 45.56,23.18 v66.99,23.18 | v74.77,46.83 104.93,46.83 106.2,48.1 TM11.2
A12  (via drill 0.35)
  Top 0.508: v12.22,9.37 11.43,10.16 11.43,18.57 10.16,19.84 10.16,27.94 14.76,32.54 v14.76,36.35 | v113.51,40.16 121.44,48.1 TM12.2
  Bottom 0.508: v12.22,9.37 U$1.A11 | v14.76,36.35 17.78,39.37 49.21,39.37 50.01,40.16 v113.51,40.16
AGND  (via drill 0.35)
  Top 0.508: U2.H3 18.41,53.98 18.41,63.66 | 18.41,63.66 18.41,66.04 U2.B2A | U$1.AGND 2.54,6.35 2.54,49.53 v7.3,54.29 | 18.41,63.66 8.73,63.66 8.73,58.58 U2.V3 | 123.83,64.61 123.83,63.66 123.98,63.5 TM10.3 123.83,63.34 123.83,53.18 | 123.83,64.61 123.83,77.31 123.98,77.47 J8.3 | 123.83,53.18 123.83,48.42 123.98,48.26 TM12.3 | U3.V3 129.38,53.18 123.83,53.18 | U3.B2A 137.64,64.61 123.83,64.61 | J7.3 108.74,77.47 108.58,77.31 108.58,63.66 108.74,63.5 TM9.3 108.58,63.34 108.58,48.42 108.74,48.26 TM11.3 | J6.3 92.23,77.47 92.08,77.31 92.08,63.66 92.23,63.5 TM6.3 92.08,63.34 92.08,48.42 92.23,48.26 TM8.3 | J5.3 76.99,77.47 76.83,77.31 76.83,63.66 76.99,63.5 TM5.3 76.83,63.34 76.83,48.42 76.99,48.26 TM7.3 | J3.3 45.24,77.31 45.09,77.15 45.09,63.66 45.24,63.5 TM1.3 45.09,63.34 45.09,48.42 45.24,48.26 TM3.3 | J4.3 60.48,77.47 60.33,77.31 60.33,63.66 60.48,63.5 TM2.3 60.33,63.34 59.53,62.55 59.53,49.21 60.48,48.26 TM4.3
  Bottom 0.508: U2.V3 v7.3,54.29 | U3.H3 138.43,57.15 U3.V3 | 46.51,76.2 45.4,77.31 J3.3 | 46.51,76.2 59.21,76.2 59.37,76.36 | 59.37,76.36 60.48,77.47 J4.3 | 75.88,76.36 75.72,76.2 59.53,76.2 59.37,76.36 | 75.88,76.36 76.99,77.47 J5.3 | 91.12,76.36 90.96,76.2 76.04,76.2 75.88,76.36 | 91.12,76.36 92.23,77.47 J6.3 | 107.63,76.36 107.47,76.2 91.28,76.2 91.12,76.36 | 107.63,76.36 108.74,77.47 J7.3 | J8.3 123.98,77.47 122.71,76.2 107.79,76.2 107.63,76.36 | U2.B2A 20.32,70.48 33.97,70.48 39.53,76.04 46.35,76.04 46.51,76.2
B1  (via drill 0.35)
  Top 0.152: v36.04,19.21 37.94,19.21 37.94,41.59 39.85,43.5 45.24,43.5 45.24,42.39 S1.3
  Bottom 0.152: U$1.11 32.86,21.43 34.61,21.43 35.72,20.32 35.72,19.21 v36.04,19.21
B2  (via drill 0.35)
  Top 0.152: U$1.12 34.77,20.8 v34.77,40.16
  Bottom 0.152: v34.77,40.16 38.1,43.5 59.37,43.5 S2.3
B3
  Top 0.152: U$1.24 41.59,22.54 41.59,28.42 45.24,32.07 S3.3
B4  (via drill 0.35)
  Top 0.152: U$1.25 44.13,22.54 v44.13,29.21
  Bottom 0.152: v44.13,29.21 45.56,30.64 55.56,30.64 56.83,31.91 56.83,33.34 59.37,33.34 S4.3
B5  (via drill 0.35)
  Top 0.152: U$1.26 46.04,21.91 46.04,26.19 46.83,26.99 v46.83,36.2 | S5.3 v74.3,39.37
  Bottom 0.152: v46.83,36.2 50.01,39.37 v74.3,39.37
B6  (via drill 0.35)
  Top 0.152: v79.22,17.78 81.92,20.48 81.92,35.24 88.74,42.07 88.74,42.7 89.53,43.5 92.39,43.5 92.39,42.39 S6.3
  Bottom 0.152: U$1.27 49.21,18.1 66.36,18.1 66.67,17.78 v79.22,17.78
B7  (via drill 0.35)
  Top 0.152: U$1.28 50.64,21.43 50.64,27.62 v52.7,29.69
  Bottom 0.152: v52.7,29.69 53.02,30 75.09,30 S7.3
B8  (via drill 0.35)
  Top 0.152: v60.33,14.13 61.44,15.24 v61.44,24.61 | v87.15,25.24 88.74,26.83 88.74,28.42 S8.3
  Bottom 0.152: U$1.42 45.88,14.13 v60.33,14.13 | v61.44,24.61 61.59,24.77 83.34,24.77 83.5,24.61 86.52,24.61 v87.15,25.24
B9  (via drill 0.35)
  Top 0.152: U$1.43 48.42,13.81 48.42,26.35 52.7,30.64 v52.7,41.43
  Bottom 0.152: v52.7,41.43 53.02,41.12 69.37,41.12 71.75,43.5 107.47,43.5 108.9,42.07 S9.3
B10  (via drill 0.35)
  Top 0.152: U$1.44 53.18,13.81 53.18,28.73 53.98,29.53 v53.98,37.31
  Bottom 0.152: v53.98,37.31 55.24,38.58 120.49,38.58 S10.3
B11  (via drill 0.35)
  Top 0.152: U$1.45 55.72,13.81 55.72,25.24 54.29,26.67 54.29,32.54 v56.36,34.61 | v106.2,34.61 108.9,31.91 S11.3
  Bottom 0.152: v106.2,34.61 v56.36,34.61
B12  (via drill 0.35)
  Top 0.152: U$1.46 56.04,13.81 56.04,26.04 56.83,26.83 v56.83,29.21
  Bottom 0.152: v56.83,29.21 57.31,29.69 121.76,29.69 S12.3
GND
  Top 0.152: 162.4,43.18 162.4,21.11 159.07,17.78 GND-SHRT.2 | 162.4,43.18 161.13,44.45 161.13,50.8 162.4,52.07 J1.1 | 162.4,43.18 J2.1 | I2C-0.2 127,2.54 123.19,6.35 123.19,8.89 IC2.9 122.24,13.02 122.24,26.04 122.71,26.51 122.71,33.18 | S10.1 119.06,42.23 121.44,42.23 S10.C 121.6,42.07 125.25,38.42 125.25,36.83 | 125.25,36.83 134.94,36.83 135.89,35.88 135.89,35.24 135.41,34.77 135.41,34.29 134.3,34.29 133.35,35.24 130.18,35.24 129.86,34.92 129.86,34.77 129.54,34.45 U1.2 | 125.25,36.83 125.25,35.72 122.71,33.18 | 122.71,33.18 S12.C 121.44,32.07 119.06,32.07 S12.1 | 105.09,31.91 106.36,31.91 S11.C | 105.09,31.91 103.98,31.91 S11.1 | 105.09,31.91 105.09,37.78 103.98,38.89 | 103.98,38.89 103.98,41.91 S9.1 | 73.34,32.07 74.45,32.07 S7.C | 73.34,32.07 72.07,32.07 S7.1 | 73.34,42.23 74.45,42.23 S5.C | 73.34,42.23 72.07,42.23 S5.1 | 73.34,42.23 73.34,32.07 | S8.1 87.47,32.23 89.85,32.23 S8.C 91.12,33.34 91.12,38.89 | 91.12,38.89 91.12,41.12 90.01,42.23 S6.C | 91.12,38.89 103.98,38.89 | U$1.G2 40.8,9.05 45.88,9.05 45.88,11.59 U$1.G1 | U$1.G6 17.62,13.81 17.62,16.99 U$1.G5 | U$1.G5 U$1.G4 | S1.C 42.7,42.39 40.32,42.39 S1.1 40.16,42.23 39.05,41.12 39.05,33.34 S3.1 | 56.99,32.23 57.94,32.23 S4.C 59.21,30.96 59.21,26.83 60.8,25.24 60.8,16.99 59.69,15.88 U$1.G3 | 56.99,32.23 55.56,32.23 S4.1 | 56.83,42.39 57.94,42.39 S2.C | 56.83,42.39 55.56,42.39 S2.1 | 56.99,32.23 56.99,36.67 56.83,36.83 56.83,42.39 | U$1.G5 17.94,17.3 17.94,33.02 16.83,34.13 LED14.K
  Bottom 0.152: U$7.GND 152.4,43.18 J2.1 | I2C-0.2 127,2.38 127.95,1.43 133.19,1.43 134.3,2.54 VIN.2 134.46,2.54 135.73,1.27 142.4,1.27 143.67,2.54 VOUT.1 143.83,2.54 146.37,5.08 153.99,5.08 153.99,12.86 158.91,17.78 GND-SHRT.2 | IC1.9 95.57,13.02 119.06,13.02 IC2.9 | S9.1 103.98,42.07 106.36,42.07 S9.C | S6.1 87.47,42.39 89.85,42.39 S6.C | S7.C 75.72,33.18 86.36,33.18 87.31,32.23 S8.1 | S12.1 117.79,30.8 107.47,30.8 106.52,31.75 S11.C | U$1.G3 58.58,13.81 48.1,13.81 U$1.G1 | U$1.G0 3.33,18.26 14.13,18.26 U$1.G4 | LED13.K 11.75,34.13 16.67,34.13 LED14.K 16.83,34.13 21.75,34.13 LED15.K 21.91,34.13 26.83,34.13 LED16.K 26.99,34.13 28.89,32.23 40.16,32.23 S3.1 40.32,32.23 42.7,32.23 S3.C 43.97,30.96 54.29,30.96 55.4,32.07 S4.1 | S7.1 70.96,30.96 59.21,30.96 S4.C
GND_MOT
  Top 0.508: POWER-5V.GND 157.64,7.62 156.05,9.21 156.05,17.78 GND-SHRT.1
  Bottom 0.508: U$7.GND2 U$7.GND1 150.02,22.7 150.97,22.7 155.89,17.78 GND-SHRT.1
I2C_SCL  (via drill 0.35)
  Top 0.152: U$1.47 57.78,10.79 57.78,11.91 58.26,12.38 v58.26,16.35 | v117.32,13.65 119.7,11.27 119.7,9.84 R5.P$2 122.87,6.67 122.87,4.29 124.46,2.7 I2C-0.3
  Bottom 0.152: v58.26,16.35 58.74,15.88 90.01,15.88 91.28,14.61 116.36,14.61 v117.32,13.65
I2C_SDA  (via drill 0.35)
  Top 0.152: U$1.48 56.04,8.73 56.04,4.76 59.21,1.59 76.68,1.59 v76.68,2.06 | I2C-0.4 121.92,5.4 121.76,5.56 R6.P$2
  Bottom 0.152: v76.68,2.06 77.15,1.59 121.13,1.59 121.92,2.38 I2C-0.4
L1  (via drill 0.35)
  Top 0.152: IC1.1 113.03,12.7 113.03,29.37 v107.16,35.24
  Bottom 0.152: v107.16,35.24 79.85,35.24 79.53,34.92 56.99,34.92 56.52,35.4 11.11,35.4 8.89,33.18 U$1.2
L2  (via drill 0.35)
  Top 0.152: v72.23,9.84 67.94,14.13 v67.94,18.41
  Bottom 0.152: IC1.2 110.17,9.84 v72.23,9.84 | v67.94,18.41 67.31,19.05 56.99,19.05 55.72,20.32 55.72,21.43 35.08,21.43 31.43,25.08 11.27,25.08 10.64,24.45 10.64,20.32 U$1.3
L3  (via drill 0.35)
  Top 0.152: IC1.3 107.63,13.02 107.63,20.16 v101.92,25.88 | v17.3,28.26 15.72,26.67 15.72,24.77 13.97,23.02 U$1.4
  Bottom 0.152: v101.92,25.88 79.69,25.88 77.31,28.26 v17.3,28.26
L4  (via drill 0.35)
  Top 0.152: IC1.4 106.68,16.99 105.09,18.57 105.09,21.11 v95.57,30.64
  Bottom 0.152: v95.57,30.64 92.55,33.66 53.98,33.66 53.66,33.34 29.05,33.34 27.3,35.08 11.27,35.08 10.32,34.13 10.32,19.21 15.4,19.21 U$1.5
L5  (via drill 0.35)
  Top 0.152: IC1.5 100.01,7.3 v100.01,6.67 | v19.05,8.73 17.94,9.84 17.94,15.88 19.05,16.99 U$1.6
  Bottom 0.152: v100.01,6.67 49.37,6.67 47.31,8.73 v19.05,8.73
L6  (via drill 0.35)
  Top 0.152: IC1.6 97.47,15.56 97.47,23.65 v94.3,26.83 | v24.29,28.89 23.02,27.62 23.02,21.75 U$1.7
  Bottom 0.152: v94.3,26.83 92.55,28.57 24.61,28.57 v24.29,28.89
L7  (via drill 0.35)
  Top 0.152: v93.19,5.56 IC1.7 | v24.29,3.33 23.02,4.6 23.02,19.21 U$1.8
  Bottom 0.152: v93.19,5.56 92.23,4.6 61.12,4.6 60.17,3.65 24.61,3.65 v24.29,3.33
L8  (via drill 0.35)
  Top 0.152: v90.65,5.56 IC1.8
  Bottom 0.152: v90.65,5.56 90.01,4.92 60.96,4.92 60.01,3.97 27.94,3.97 27.78,4.13 27.15,4.13 26.99,3.97 10,3.97 U$1.23
L9  (via drill 0.35)
  Top 0.152: v66.99,18.41 v68.58,20
  Bottom 0.152: IC2.1 140.97,17.46 141.45,17.46 141.92,17.94 141.92,21.27 91.44,21.27 88.9,23.81 80.17,23.81 76.36,20 v68.58,20 | v66.99,18.41 66.67,18.73 56.52,18.73 56.04,19.21 53.18,19.21 U$1.29
L10  (via drill 0.35)
  Top 0.152: U$1.30 54.61,17.94 v55.09,17.46 53.5,15.88 53.5,9.05 U$1.37
  Bottom 0.152: IC2.2 134.62,15.24 91.6,15.24 90.01,16.83 60.64,16.83 60.01,17.46 v55.09,17.46
L11  (via drill 0.35)
  Top 0.152: U$1.38 49.53,7.62 U$1.50 | U$1.31 57.31,20.16 v57.31,16.35
  Bottom 0.152: IC2.3 134.14,9.68 110.49,9.68 108.11,7.3 69.53,7.3 | 69.53,7.3 56.04,7.3 55.72,6.99 52.7,6.99 U$1.50 | v57.31,16.35 58.26,15.4 61.44,15.4 69.53,7.3
L12  (via drill 0.35)
  Top 0.152: U$1.32 v59.69,16.83 58.58,15.72 58.58,11.75 v58.42,11.59
  Bottom 0.152: IC2.4 129.86,14.92 91.44,14.92 89.85,16.51 60.01,16.51 v59.69,16.83 | U$1.49 53.5,11.59 v58.42,11.59
LED1
  Top 0.152: IC1.18 113.35,20 113.35,36.04 107.63,41.75 107.63,42.39 105.89,44.13 78.26,44.13 78.26,25.4 75.56,22.7 75.56,20.95 R1.P$2
LED2  (via drill 0.35)
  Top 0.152: v106.68,24.13 IC1.17 | v77.95,24.13 78.11,23.97 78.11,21.11 71.75,14.76 R2.P$2
  Bottom 0.152: v77.95,24.13 v106.68,24.13
LED3  (via drill 0.35)
  Top 0.152: v73.98,18.41 73.5,18.41 70.48,15.4 70.48,14.13 71.28,13.34 74.3,13.34 R3.P$2
  Bottom 0.152: IC1.16 107.63,17.46 80.49,17.46 79.53,18.41 v73.98,18.41
LED4  (via drill 0.35)
  Top 0.152: v77.95,20 76.83,18.89 R4.P$2
  Bottom 0.152: IC1.15 104.78,20.95 91.28,20.95 88.74,23.5 82.71,23.5 81.92,22.7 81.92,20 v77.95,20
LED5  (via drill 0.35)
  Top 0.152: IC1.14 100.01,14.92 v100.01,13.97
  Bottom 0.152: v100.01,13.97 99.38,13.34 81.92,13.34 R17.P$2
LED6  (via drill 0.35)
  Top 0.152: v86.52,20.64 83.19,17.3 R18.P$2
  Bottom 0.152: IC1.13 100.01,20.64 v86.52,20.64
LED7
  Top 0.152: IC1.12 97.79,20.32 97.79,24.29 94.61,27.46 93.66,27.46 93.66,24.45 85.72,16.51 R19.P$2
LED8
  Top 0.152: IC1.11 96.52,15.88 94.46,13.81 88.27,13.81 R20.P$2
LED9  (via drill 0.35)
  Top 0.152: v106.05,16.67 102.55,13.18 102.55,10.32 97.16,4.92 83.82,4.92 83.82,11.59 83.19,12.22 81.28,12.22 81.28,9.84 74.93,3.49 R9.P$2
  Bottom 0.152: IC2.18 139.38,20.64 117.95,20.64 113.98,16.67 v106.05,16.67
LED10
  Bottom 0.152: IC2.17 138.43,13.97 139.7,12.7 139.7,9.05 110.81,9.05 103.66,1.91 78.9,1.91 77.47,3.33 R10.P$2
LED11
  Bottom 0.152: IC2.16 135.89,14.45 137.48,14.45 139.38,12.54 139.38,9.37 110.65,9.37 103.5,2.22 81.12,2.22 80.01,3.33 R11.P$2
LED12
  Top 0.152: IC2.15 132.08,17.78 132.08,2.86 130.33,1.11 82.55,1.11 R12.P$2
M_AIN  (via drill 0.35)
  Top 0.152: U$7.AIN1 129.54,35.56 128.91,34.92 128.91,34.61 128.75,34.45 U1.3 | U$1.40 38.26,13.81 38.26,28.57 41.59,31.91 v41.59,40.16
  Bottom 0.152: v41.59,40.16 42.23,40.8 116.05,40.8 118.59,43.34 130.33,43.34 134.3,39.37 134.94,39.37 135.89,38.42 135.89,35.56 U$7.AIN1
M_BIN  (via drill 0.35)
  Top 0.152: v132.72,29.84 132.72,32.07 130.49,34.29 U1.1 | U$1.41 43.34,14.13 48.1,14.13 48.1,12.7 49.21,11.59 50.96,11.59 50.96,26.99 53.34,29.37 v53.34,33.97
  Bottom 0.152: U$7.BIN2 v132.72,29.84 130.97,29.84 126.84,33.97 v53.34,33.97
M_JOYB
  Top 0.152: U$1.0 7.94,24.45 7.94,63.82 15.88,71.75 17.14,71.75 U2.B1A
M_JOYH
  Top 0.508: U$1.18 20.32,6.35 U2.H2
M_JOYV  (via drill 0.35)
  Top 0.508: U$1.17 26.35,7.3 26.35,18.26 27.94,19.84 27.94,22.86 28.42,23.34 28.42,50.16 23.65,54.93 v23.65,57.31
  Bottom 0.508: v23.65,57.31 21.27,59.69 U2.V2
M_PWMA  (via drill 0.35)
  Top 0.152: U$1.21 12.86,6.19 12.86,15.88 13.81,16.83 13.81,19.05 12.86,20 12.86,23.18 15.4,25.72 v15.4,38.1
  Bottom 0.152: v15.4,38.1 23.02,45.72 129.54,45.72 U$7.PWMA
M_PWMB  (via drill 0.35)
  Top 0.152: v105.89,6.03 110.81,10.95 110.81,16.03 112.71,17.94 112.71,21.59 v112.39,21.91
  Bottom 0.152: U$1.22 12.54,6.19 99.54,6.19 99.69,6.03 v105.89,6.03 | v112.39,21.91 115.89,25.4 U$7.PWMB
N$1  (via drill 0.35)
  Top 0.152: v47.78,22.38 47.78,38.58 44.13,38.58 42.86,37.31 S1.A
  Bottom 0.152: v47.78,22.38 47.94,22.23 R1.P$1
N$2
  Top 0.152: R13.P$1 12.7,32.38 12.7,35.72 11.75,36.67 LED13.A
N$3
  Top 0.152: LED14.A 16.67,36.67 15.88,35.88 15.88,32.23 16.51,31.59 R14.P$1
N$4
  Top 0.152: R15.P$1 20.95,32.38 20.95,35.88 21.75,36.67 LED15.A
N$5  (via drill 0.35)
  Top 0.152: v132.08,31.59 130.49,31.59 U1.6
  Bottom 0.152: v132.08,31.59 133.19,30.48 U$7.BIN1
N$6  (via drill 0.35)
  Top 0.152: v127.64,34.13 127.64,32.7 128.59,31.75 U1.4
  Bottom 0.152: v127.64,34.13 131.6,38.1 U$7.AIN2
N$7
  Top 0.152: R16.P$1 26.04,32.38 26.04,35.88 26.83,36.67 LED16.A
N$8  (via drill 0.35)
  Top 0.152: v70.8,35.56 70.8,23.18 R2.P$1
  Bottom 0.152: S2.A 59.69,35.56 v70.8,35.56
N$9
  Bottom 0.152: R3.P$1 73.03,20.95 68.74,20.95 67.94,21.75 42.86,21.75 42.86,26.99 S3.A
N$10
  Bottom 0.152: S4.A 61.28,23.81 75.25,23.81 R4.P$1
N$15
  Top 0.152: S9.A 106.36,36.99 105.09,38.26 105.09,42.39 103.66,43.81 78.58,43.81 78.58,14.61 74.93,10.95 R9.P$1
N$16  (via drill 0.35)
  Top 0.152: v99.69,35.88 91.12,27.3 91.12,22.86 84.45,16.19 84.45,14.13 83.19,12.86 77.47,12.86 R10.P$1
  Bottom 0.152: S10.A 120.33,35.88 v99.69,35.88
N$17  (via drill 0.35)
  Top 0.152: v94.93,25.24 87.31,17.62 87.31,15.4 87,15.08 87,14.13 85.41,12.54 80.01,12.54 R11.P$1
  Bottom 0.152: v94.93,25.24 104.93,25.24 106.36,26.67 S11.A
N$18
  Top 0.152: S12.A 115.25,20.64 115.25,10.32 113.98,9.05 109.38,9.05 109.38,8.57 105.41,4.6 82.55,4.6 R12.P$1
N$19  (via drill 0.35)
  Top 0.152: v79.22,35.56 80.64,34.13 R17.P$1
  Bottom 0.152: v79.22,35.56 76.04,35.56 74.61,36.99 S5.A
N$20
  Top 0.152: S6.A 83.19,30.48 R18.P$1
N$21  (via drill 0.35)
  Top 0.152: v83.82,25.24 85.72,23.34 R19.P$1
  Bottom 0.152: v83.82,25.24 76.2,25.24 74.61,26.83 S7.A
N$22
  Top 0.152: S8.A 88.27,25.4 R20.P$1
N$45
  Bottom 0.508: MOTORS1.P$1 U$7.BO1
N$46
  Bottom 0.508: MOTORS1.P$2 U$7.BO2
N$52
  Bottom 0.508: MOTORS1.P$3 U$7.AO2
N$54
  Bottom 0.508: MOTORS1.P$4 U$7.AO1
S1  (via drill 0.35)
  Top 0.152: v30.8,24.45 31.27,24.92 v31.27,52.23
  Bottom 0.152: v30.8,24.45 U$1.9 | v31.27,52.23 37.47,58.42 161.13,58.42 162.4,57.15 J1.3
S2  (via drill 0.35)
  Top 0.152: U$1.10 31.91,23.02 v31.91,48.58
  Bottom 0.152: v31.91,48.58 33.02,49.69 139.22,49.69 140.65,48.26 J2.3
S_JOYB
  Bottom 0.152: U$1.1 6.35,52.39 5.71,52.39 5.4,52.7 5.4,64.77 34.77,64.77 38.73,68.74 137.32,68.74 140.34,71.75 U3.B1A
S_JOYH  (via drill 0.35)
  Top 0.508: U$1.20 15.24,6.35 v15.24,15.24 | v21.11,15.88 22.38,17.14 22.38,19.37 22.86,19.84 22.86,20.8 25.4,23.34 v25.4,48.58
  Bottom 0.508: v15.24,15.24 15.88,15.88 v21.11,15.88 | v25.4,48.58 27.78,50.96 142.08,50.96 U3.H2
S_JOYV  (via drill 0.35)
  Top 0.508: U$1.19 17.78,3.81 5.08,3.81 5.08,20.8 8.89,24.61 8.89,42.55 v16.35,50.01
  Bottom 0.508: v16.35,50.01 22.7,56.36 34.61,56.36 37.94,59.69 U3.V2
U1
  Bottom 0.152: U$1.51 43.34,11.27 41.91,11.27 40.8,12.38 40.8,14.61 42.07,14.61 42.39,14.92 42.39,16.99 26.04,16.99 22.7,20.32 22.7,22.7 13.02,22.7 11.91,23.81 R13.P$2
U2  (via drill 0.35)
  Top 0.152: v14.45,11.59 14.13,11.91 14.13,19.05 15.4,20.32 15.4,22.7 16.51,23.81 R14.P$2
  Bottom 0.152: U$1.52 40.48,11.59 v14.45,11.59
U3  (via drill 0.35)
  Top 0.152: U$1.53 36.04,13.49 v36.04,17.62
  Bottom 0.152: v36.04,17.62 34.45,19.21 26.35,19.21 25.24,20.32 25.24,23.81 21.91,23.81 R15.P$2
U4
  Top 0.152: U$1.54 25.56,11.59 25.56,20.64 26.83,21.91 26.83,23.81 R16.P$2
VMOT
  Top 0.508: U$7.VMOT 142.08,17.62 142.08,3.81 140.81,2.54 VOUT.2